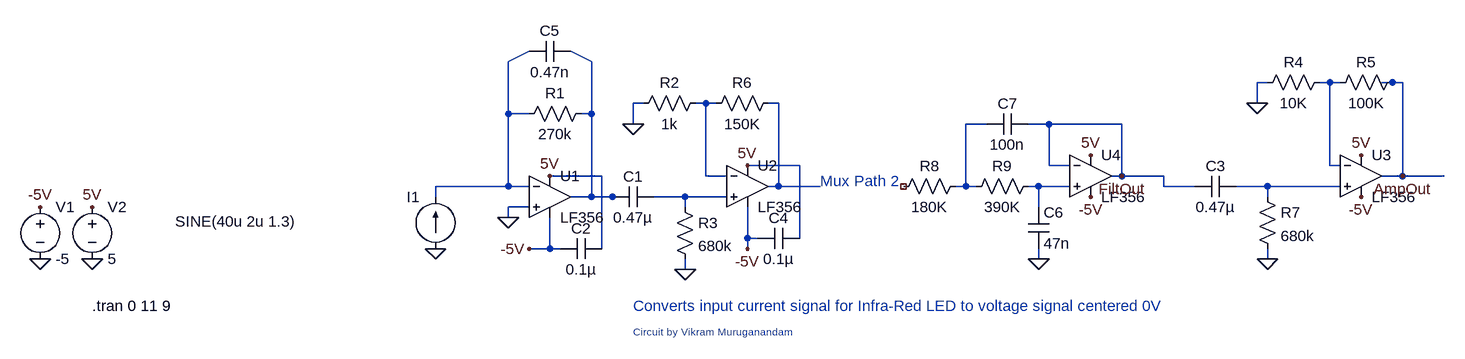
[diagram p0: schematic SigAmpPath2High.asc]
SigAmpPath2High.asc, the LTspice schematic file:
Version 4
SHEET 1 1848 680
WIRE 80 -32 112 -48
WIRE 208 -32 176 -48
WIRE 1248 0 1232 0
WIRE 1344 0 1328 0
WIRE 1360 0 1344 0
WIRE 1440 0 1424 0
WIRE 1456 0 1440 0
WIRE 288 32 272 32
WIRE 384 32 368 32
WIRE 400 32 384 32
WIRE 496 32 480 32
WIRE 1232 32 1232 0
WIRE 80 48 80 -32
WIRE 112 48 80 48
WIRE 208 48 208 -32
WIRE 208 48 192 48
WIRE 272 64 272 32
WIRE 816 64 784 64
WIRE 912 64 880 64
WIRE 1024 64 912 64
WIRE 528 128 448 128
WIRE 912 128 912 64
WIRE 944 128 912 128
WIRE 1344 128 1344 0
WIRE 1360 128 1344 128
WIRE 224 144 144 144
WIRE 384 144 384 32
WIRE 416 144 384 144
WIRE 1024 144 1024 64
WIRE 1024 144 1008 144
WIRE 1088 144 1024 144
WIRE 1456 144 1456 0
WIRE 1456 144 1424 144
WIRE 1520 144 1456 144
WIRE 80 160 80 48
WIRE 80 160 -32 160
WIRE 112 160 80 160
WIRE 496 160 496 32
WIRE 496 160 480 160
WIRE 560 160 496 160
WIRE 784 160 784 64
WIRE 784 160 768 160
WIRE 800 160 784 160
WIRE 896 160 880 160
WIRE 944 160 896 160
WIRE 1088 160 1088 144
WIRE 1136 160 1088 160
WIRE 1248 160 1200 160
WIRE 1360 160 1248 160
WIRE -32 176 -32 160
WIRE 208 176 208 48
WIRE 208 176 176 176
WIRE 240 176 208 176
WIRE 256 176 240 176
WIRE 352 176 304 176
WIRE 416 176 352 176
WIRE 1248 176 1248 160
WIRE 112 192 80 192
WIRE 352 192 352 176
WIRE 896 192 896 160
WIRE 80 208 80 192
WIRE 448 240 448 192
WIRE 464 240 448 240
WIRE 528 240 528 128
WIRE 144 256 144 208
WIRE 144 256 112 256
WIRE 160 256 144 256
WIRE 224 256 224 144
WIRE 448 256 448 240
WIRE 896 272 896 256
WIRE 1248 272 1248 256
WIRE 352 288 352 272
FLAG -640 272 0
FLAG -560 272 0
FLAG -560 192 5V
FLAG 144 144 5V
FLAG -640 192 -5V
FLAG 112 256 -5V
FLAG 80 208 0
FLAG -32 256 0
FLAG 448 128 5V
FLAG 448 256 -5V
FLAG 1392 176 -5V
FLAG 1392 112 5V
FLAG 352 288 0
FLAG 272 64 0
FLAG 1248 272 0
FLAG 1232 32 0
FLAG 1456 144 AmpOut
FLAG 896 272 0
FLAG 976 112 5V
FLAG 976 176 -5V
FLAG 1024 144 FiltOut
SYMBOL LF356 144 112 R0
SYMATTR InstName U1
SYMBOL voltage -640 176 R0
WINDOW 123 0 0 Left 0
WINDOW 39 0 0 Left 0
SYMATTR InstName V1
SYMATTR Value -5
SYMBOL voltage -560 176 R0
WINDOW 123 0 0 Left 0
WINDOW 39 0 0 Left 0
SYMATTR InstName V2
SYMATTR Value 5
SYMBOL current -32 256 R180
WINDOW 0 24 80 Left 2
WINDOW 3 214 42 Left 2
WINDOW 123 0 0 Left 0
WINDOW 39 0 0 Left 0
SYMATTR InstName I1
SYMATTR Value SINE(40u 2u 1.3)
SYMBOL res 208 32 R90
WINDOW 0 0 56 VBottom 2
WINDOW 3 32 56 VTop 2
SYMATTR InstName R1
SYMATTR Value 270k
SYMBOL cap 304 160 R90
WINDOW 0 0 32 VBottom 2
WINDOW 3 32 32 VTop 2
SYMATTR InstName C1
SYMATTR Value 0.47µ
SYMBOL LF356 448 96 R0
SYMATTR InstName U2
SYMBOL LF356 1392 80 R0
SYMATTR InstName U3
SYMBOL res 1456 -16 R90
WINDOW 0 0 56 VBottom 2
WINDOW 3 32 56 VTop 2
SYMATTR InstName R5
SYMATTR Value 100K
SYMBOL res 496 16 R90
WINDOW 0 0 56 VBottom 2
WINDOW 3 32 56 VTop 2
SYMATTR InstName R6
SYMATTR Value 150K
SYMBOL cap 224 240 R90
WINDOW 0 0 32 VBottom 2
WINDOW 3 32 32 VTop 2
SYMATTR InstName C2
SYMATTR Value 0.1µ
SYMBOL res 336 176 R0
SYMATTR InstName R3
SYMATTR Value 680k
SYMBOL res 384 16 R90
WINDOW 0 0 56 VBottom 2
WINDOW 3 32 56 VTop 2
SYMATTR InstName R2
SYMATTR Value 1k
SYMBOL cap 1200 144 R90
WINDOW 0 0 32 VBottom 2
WINDOW 3 32 32 VTop 2
SYMATTR InstName C3
SYMATTR Value 0.47µ
SYMBOL res 1232 160 R0
SYMATTR InstName R7
SYMATTR Value 680k
SYMBOL cap 528 224 R90
WINDOW 0 0 32 VBottom 2
WINDOW 3 32 32 VTop 2
SYMATTR InstName C4
SYMATTR Value 0.1µ
SYMBOL res 1344 -16 R90
WINDOW 0 0 56 VBottom 2
WINDOW 3 32 56 VTop 2
SYMATTR InstName R4
SYMATTR Value 10K
SYMBOL cap 176 -64 R90
WINDOW 0 0 32 VBottom 2
WINDOW 3 32 32 VTop 2
SYMATTR InstName C5
SYMATTR Value 0.47n
SYMBOL res 784 144 R90
WINDOW 0 0 56 VBottom 2
WINDOW 3 32 56 VTop 2
SYMATTR InstName R8
SYMATTR Value 180K
SYMBOL res 896 144 R90
WINDOW 0 0 56 VBottom 2
WINDOW 3 32 56 VTop 2
SYMATTR InstName R9
SYMATTR Value 390K
SYMBOL LF356 976 80 R0
SYMATTR InstName U4
SYMBOL cap 880 192 R0
SYMATTR InstName C6
SYMATTR Value 47n
SYMBOL cap 880 48 R90
WINDOW 0 0 32 VBottom 2
WINDOW 3 32 32 VTop 2
SYMATTR InstName C7
SYMATTR Value 100n
TEXT -560 344 Left 2 !.tran 0 11 9
TEXT 272 384 Left 1 ;Circuit by Vikram Muruganandam
TEXT 272 344 Left 2 ;Converts input current signal for Infra-Red LED to voltage signal centered 0V
TEXT 560 152 Left 2 ;Mux Path 2

The netlist it stands for:
* SigAmpPath2High.asc
XU1 0 N001 5V -5V N002 LF356  ; pins In+ In- V+ V- OUT
V1 -5V 0 -5
V2 5V 0 5
I1 0 N001 SINE(40u 2u 1.3)
R1 N002 N001 270k
C1 N009 N002 0.47µ
XU2 N009 N004 5V -5V N005 LF356  ; pins In+ In- V+ V- OUT
XU3 N008 N003 5V -5V AmpOut LF356  ; pins In+ In- V+ V- OUT
R5 AmpOut N003 100K
R6 N005 N004 150K
C2 5V -5V 0.1µ
R3 N009 0 680k
R2 N004 0 1k
C3 N008 FiltOut 0.47µ
R7 N008 0 680k
C4 5V -5V 0.1µ
R4 N003 0 10K
C5 N002 N001 0.47n
R8 N006 NC_01 180K
R9 N007 N006 390K
XU4 N007 FiltOut 5V -5V FiltOut LF356  ; pins In+ In- V+ V- OUT
C6 N007 0 47n
C7 FiltOut N006 100n
.tran 0 11 9
* Circuit by Vikram Muruganandam
* Converts input current signal for Infra-Red LED to voltage signal centered 0V
* Mux Path 2
.lib LF356.sub
.backanno
.end